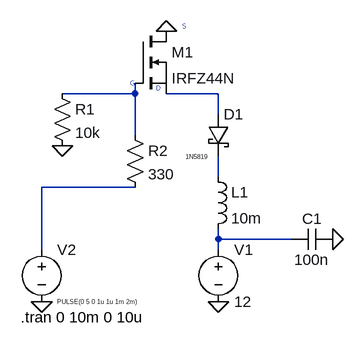
[diagram p0: schematic ESC.asc]
ESC.asc, the LTspice schematic file:
Version 4
SHEET 1 880 680
WIRE 96 -96 96 -112
WIRE 96 -96 -16 -96
WIRE 224 -96 144 -96
WIRE 224 -64 224 -96
WIRE 96 -32 96 -96
WIRE 224 32 224 0
WIRE 96 48 -48 48
WIRE 224 128 224 112
WIRE 336 128 224 128
WIRE -48 144 -48 48
WIRE 224 144 224 128
FLAG 144 -192 0
FLAG 224 224 0
FLAG -48 224 0
FLAG -16 -16 0
FLAG 400 128 0
SYMBOL nmos 96 -192 R0
SYMATTR InstName M1
SYMATTR Value IRFZ44N
SYMBOL schottky 208 -64 R0
WINDOW 3 -34 65 Left 0
SYMATTR InstName D1
SYMATTR Value 1N5819
SYMATTR Description Diode
SYMATTR Type diode
SYMBOL res -32 -112 R0
SYMATTR InstName R1
SYMATTR Value 10k
SYMBOL res 80 -48 R0
SYMATTR InstName R2
SYMATTR Value 330
SYMBOL voltage 224 128 R0
SYMATTR InstName V1
SYMATTR Value 12
SYMBOL voltage -48 128 R0
WINDOW 3 24 96 Left 0
WINDOW 123 0 0 Left 0
WINDOW 39 0 0 Left 0
SYMATTR InstName V2
SYMATTR Value PULSE(0 5 0 1u 1u 1m 2m)
SYMBOL cap 400 112 R90
WINDOW 0 0 32 VBottom 2
WINDOW 3 32 32 VTop 2
SYMATTR InstName C1
SYMATTR Value 100n
SYMBOL ind 208 16 R0
SYMATTR InstName L1
SYMATTR Value 10m
TEXT 88 -112 Left 0 ;G
TEXT 168 -200 Left 0 ;S
TEXT 128 -104 Left 0 ;D
TEXT -80 248 Left 2 !.tran 0 10m 0 10u

The netlist it stands for:
* ESC.asc
M1 0 N001 N002 N002 IRFZ44N
D1 N002 N003 1N5819
R1 N001 0 10k
R2 N001 N004 330
V1 N005 0 12
V2 N004 0 PULSE(0 5 0 1u 1u 1m 2m)
C1 0 N005 100n
L1 N003 N005 10m
.model D D
.lib standard.dio
.model NMOS NMOS
.model PMOS PMOS
.lib standard.mos
* G
* S
* D
.tran 0 10m 0 10u
.backanno
.end